# EAGLE design Xmega (EAGLE 6.2)
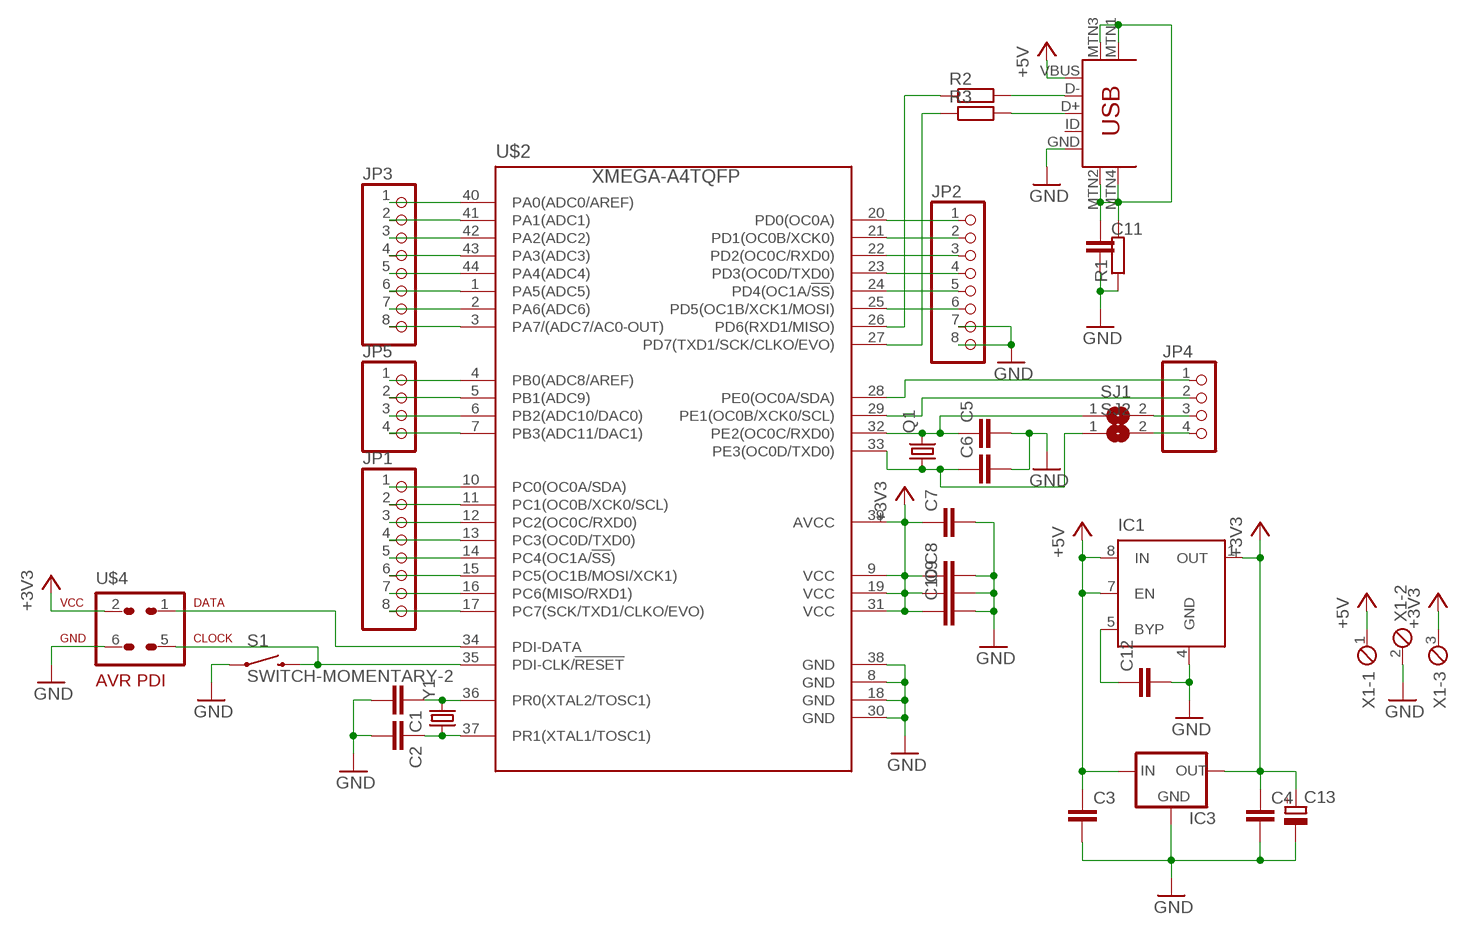
[diagram p0: schematic, sheet 1]

## Parts
C1  C-EUC0603  [C0603]
C2  C-EUC0603  [C0603]
C3  C-EUC0805  [C0805]
C4  C-EUC0805  [C0805]
C5  C-EUC0603  [C0603]
C6  C-EUC0603  [C0603]
C7  C-EUC0603  [C0603]
C8  C-EUC0603  [C0603]
C9  C-EUC0603  [C0603]
C10  C-EUC0603  [C0603]
C11  C-EUC0603  [C0603]
C12  C-EUC0603  [C0603]
C13  CPOL-EUSMCB  [SMC_B]
IC1  TC1269  [MSOP08]
IC3  VREG_3PIN_O-G-ITO92_MID  [TO92_MID]
JP1  PINHD_FIXEDPAD_ROUND-1X8  [1X08_ROUND]
JP2  PINHD_FIXEDPAD_ROUND-1X8  [1X08_ROUND]
JP3  PINHD_FIXEDPAD_ROUND-1X8  [1X08_ROUND]
JP4  PINHD_FIXEDPAD_ROUND-1X4  [1X04_ROUND]
JP5  PINHD_FIXEDPAD_ROUND-1X4  [1X04_ROUND]
Q1  CRYSTALTC26V  [TC26V]
R1  R-EU_R0603  [R0603]
R2  R-EU_R0603  [R0603]
R3  R-EU_R0603  [R0603]
S1  SWITCH-MOMENTARY-2  [TACTILE_SWITCH_TALL]
SJ1  SJ_SMALL  [SJ_2S-NO]
SJ2  SJ_SMALL  [SJ_2S-NO]
U$1  USB-MINIB-5PIN  [USB-MINIB]
U$2  XMEGA-A4TQFP  [TQFP44]
U$4  AVR-PDIVERT  [AVR-ISP-6]
X1  MPT3  [3POL254]
Y1  CRYSTAL5X3  [CRYSTAL-SMD-5X3]

## Nets
+3V3: C4.1 C7.1 C8.1 C9.1 C10.1 C13.+ IC1.1(OUT) IC3.1(OUT) U$2.9(VCC) U$2.19(VCC) U$2.31(VCC) U$2.39(AVCC) U$4.2 X1.3
+5V: C3.1 IC1.7(EN) IC1.8(IN) IC3.3(IN) U$1.VBUS X1.1
GND: C1.2 C2.2 C3.2 C4.2 C5.2 C6.2 C7.2 C8.2 C9.2 C10.2 C11.2 C12.2 C13.- IC1.4(GND) IC3.2(GND) JP2.7 JP2.8 R1.1 S1.A2 U$1.GND U$2.8(GND) U$2.18(GND) U$2.30(GND) U$2.38(GND) U$4.6 X1.2
MTN: C11.1 R1.2 U$1.MTN1(MTN2) U$1.MTN2(MTN3) U$1.MTN3(MTN1) U$1.MTN4
N$1: C1.1 U$2.36(PR0(XTAL2/TOSC1)) Y1.3
N$2: C2.1 U$2.37(PR1(XTAL1/TOSC1)) Y1.1
N$5: JP2.2 U$2.21(PD1(OC0B/XCK0))
N$6: JP2.3 U$2.22(PD2(OC0C/RXD0))
N$7: JP2.4 U$2.23(PD3(OC0D/TXD0))
N$8: JP2.5 U$2.24(PD4(OC1A/!SS!))
N$10: R2.1 U$2.26(PD6(RXD1/MISO))
N$11: R3.1 U$2.27(PD7(TXD1/SCK/CLKO/EVO))
N$17: JP3.2 U$2.41(PA1(ADC1))
N$18: JP3.3 U$2.42(PA2(ADC2))
N$19: JP3.4 U$2.43(PA3(ADC3))
N$20: JP3.5 U$2.44(PA4(ADC4))
N$21: JP3.6 U$2.1(PA5(ADC5))
N$22: JP3.7 U$2.2(PA6(ADC6))
N$25: JP1.2 U$2.11(PC1(OC0B/XCK0/SCL))
N$26: JP1.3 U$2.12(PC2(OC0C/RXD0))
N$27: JP1.4 U$2.13(PC3(OC0D/TXD0))
N$28: JP1.5 U$2.14(PC4(OC1A/!SS!))
N$29: JP1.6 U$2.15(PC5(OC1B/MOSI/XCK1))
N$30: JP1.7 U$2.16(PC6(MISO/RXD1))
N$33: JP5.2 U$2.5(PB1(ADC9))
N$34: JP5.3 U$2.6(PB2(ADC10/DAC0))
N$36: S1.B2 U$2.35(PDI-CLK/!RESET) U$4.5
N$38: R3.2 U$1.D+
N$39: R2.2 U$1.D-
N$40: C12.1 IC1.5(BYP)
N$42: U$2.34(PDI-DATA) U$4.1
XA0: JP3.1 U$2.40(PA0(ADC0/AREF))
XA7: JP3.8 U$2.3(PA7/(ADC7/AC0-OUT))
XB0: JP5.1 U$2.4(PB0(ADC8/AREF))
XB3: JP5.4 U$2.7(PB3(ADC11/DAC1))
XC0: JP1.1 U$2.10(PC0(OC0A/SDA))
XC7: JP1.8 U$2.17(PC7(SCK/TXD1/CLKO/EVO))
XD0: JP2.1 U$2.20(PD0(OC0A))
XD5: JP2.6 U$2.25(PD5(OC1B/XCK1/MOSI))
XE0: JP4.1 U$2.28(PE0(OC0A/SDA))
XE1: JP4.2 U$2.29(PE1(OC0B/XCK0/SCL))
XE2: C5.1 Q1.2 SJ1.1 U$2.32(PE2(OC0C/RXD0))
XE2S: JP4.3 SJ1.2
XE3: C6.1 Q1.1 SJ2.1 U$2.33(PE3(OC0D/TXD0))
XE3S: JP4.4 SJ2.2
Unconnected: U$1.ID

## Library data of the parts
C1-C12 = rcl:C-EU: CAPACITOR, European symbol
C13 = rcl:CPOL-EU: POLARIZED CAPACITOR, European symbol
IC1 = hsa:TC1269: Connecting a 470pF to the BYP input further reduces output noise. The regulator is enabled when a logic high (input voltage x 0.45) is applied to the EN input. Max input voltage 6.0V, max output current 300mA.
IC3 = hsa:VREG_3PIN_O-G-I: Pin order 1:OUT, 2:GND, 3:IN
JP1-JP3 = hsa:PINHD_FIXEDPAD_ROUND-1X8: PIN HEADER
JP4 JP5 = hsa:PINHD_FIXEDPAD_ROUND-1X4: PIN HEADER
Q1 = crystal:CRYSTAL: CRYSTAL; OC_FARNELL: unknown; OC_NEWARK: unknown
R1-R3 = rcl:R-EU_: RESISTOR, European symbol
S1 = SparkFun:SWITCH-MOMENTARY-2
SJ1 SJ2 = hsa:SJ_SMALL: SMD solder JUMPER
U$1 = SparkFun:USB-MINIB: Mini-USB "B" connector with 5th pin broken out. Created new symbol breaking out 5th "ID" pin in mini/micro USB connector spec. See: http://en.wikipedia.org/wiki/Mini_usb#Cables. Uses same footprint as 4-pin symbol. Also added pins to connect to mounting / shield pads if required (probably not generally needed as signals aren't shielded once they leave the connector).
U$2 = avr-7:XMEGA-A4: Atmel XMega A4 series processor
U$4 = avr-7:AVR-PDI: AVR PDI programming interface connector
X1 = con-phoenix-254:MPT3: PHOENIX CONNECTOR; OC_FARNELL: unknown; OC_NEWARK: unknown
Y1 = SparkFun:CRYSTAL: Crystals Various standard crystals. Proven footprints. Spark Fun Electronics SKU : COM-00534

## Board
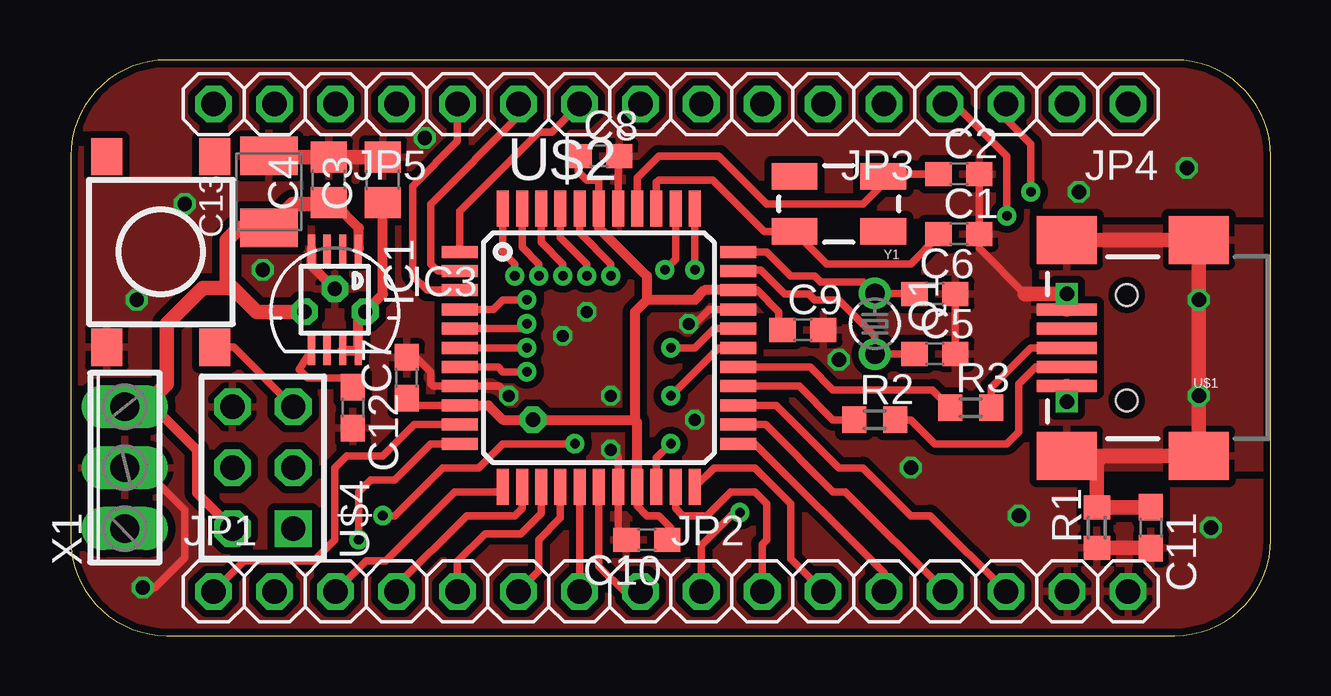
[diagram p1: board, top side]
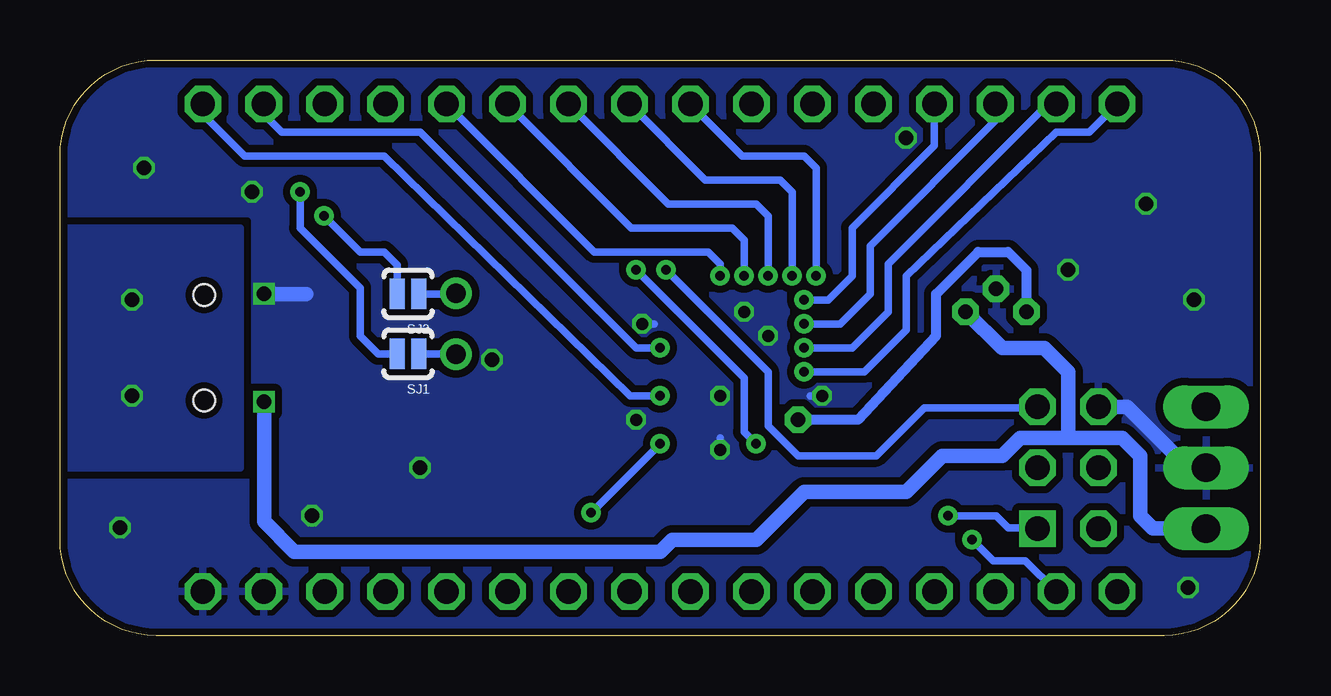
[diagram p2: board, bottom side, seen from below]

Size 50 x 24 mm. Coordinates in mm from the lower left corner, seen from the top.
Outline: 46,0 arc90 50,4 50,20 arc90 46,24 4,24 arc90 0,20 0,4 arc90 4,0 46,0
Copper layers (1*16): Top 0.035mm / dielectric 1.5mm / Bottom 0.035mm
Design rules: minimum track width 6mil, minimum drill 12mil, track to track 6mil, track to pad 6mil, pad to pad 6mil, via to via 6mil, smd to smd 0mil, copper to edge 10mil, drill to drill 10mil, minimum pad ring 10mil, minimum via ring 6mil, stop-mask expansion 2mil, vias tented up to drill 100mil, thermal gap 10mil

### Footprints (pad centres in the part's own frame; a part is rotated, then mirrored left to right if it is on the bottom)
C0603 = smd 1.1 x 1: 1 -0.85,0; 2 0.85,0
C0805 = smd 1.3 x 1.5: 1 -0.95,0; 2 0.95,0
SMC_B = smd 1.6 x 2.4: + -1.5,0; - 1.5,0
MSOP08 = smd 0.3 x 1.2: 1 -0.976,-2.113; 2 -0.326,-2.113; 3 0.324,-2.113; 4 0.974,-2.113; 5 0.974,2.112; 6 0.324,2.112; 7 -0.326,2.112; 8 -0.976,2.112
TO92_MID = drill 0.6 octagon: 1 -1.27,0; 2 0,0.953; 3 1.27,0
1X08_ROUND = drill 1.016 pad 1.524 octagon: 1 -8.89,0; 2 -6.35,0; 3 -3.81,0; 4 -1.27,0; 5 1.27,0; 6 3.81,0; 7 6.35,0; 8 8.89,0
1X04_ROUND = drill 1.016 pad 1.524 octagon: 1 -3.81,0; 2 -1.27,0; 3 1.27,0; 4 3.81,0
TC26V = drill 0.813: 1 -1.27,0; 2 1.27,0
R0603 = smd 1 x 1.1: 1 -0.85,0; 2 0.85,0
TACTILE_SWITCH_TALL = smd 1.55 x 1.3: A1 -3.975,-2.25; A2 3.975,-2.25; B1 -3.975,2.25; B2 3.975,2.25
SJ_2S-NO = smd 0.635 x 1.27: 1 -0.45,0; 2 0.45,0
USB-MINIB = smd 2.5 x 0.5: D+ 2.5,0; D- 2.5,0.8; GND 2.5,-1.6; ID 2.5,-0.8; VBUS 2.5,1.6 | smd 2.5 x 2: MTN1 -3,4.5; MTN2 2.5,4.5; MTN3 -3,-4.5; MTN4 2.5,-4.5 | hole 0.9: 0,2.2; 0,-2.2
TQFP44 = smd 1.5 x 0.5: 1 -5.8,4; 2 -5.8,3.2; 3 -5.8,2.4; 4 -5.8,1.6; 5 -5.8,0.8; 6 -5.8,0; 7 -5.8,-0.8; 8 -5.8,-1.6; 9 -5.8,-2.4; 10 -5.8,-3.2; 11 -5.8,-4; 23 5.8,-4; 24 5.8,-3.2; 25 5.8,-2.4; 26 5.8,-1.6; 27 5.8,-0.8; 28 5.8,0; 29 5.8,0.8; 30 5.8,1.6; 31 5.8,2.4; 32 5.8,3.2; 33 5.8,4 | smd 0.5 x 1.5: 12 -4,-5.8; 13 -3.2,-5.8; 14 -2.4,-5.8; 15 -1.6,-5.8; 16 -0.8,-5.8; 17 0,-5.8; 18 0.8,-5.8; 19 1.6,-5.8; 20 2.4,-5.8; 21 3.2,-5.8; 22 4,-5.8; 34 4,5.8; 35 3.2,5.8; 36 2.4,5.8; 37 1.6,5.8; 38 0.8,5.8; 39 0,5.8; 40 -0.8,5.8; 41 -1.6,5.8; 42 -2.4,5.8; 43 -3.2,5.8; 44 -4,5.8
AVR-ISP-6 = drill 1.016 square: 1 -2.54,-1.27 | drill 1.016 octagon: 2 -2.54,1.27; 3 0,-1.27; 4 0,1.27; 5 2.54,-1.27; 6 2.54,1.27
3POL254 = drill 1.2 long: 1 -2.54,0; 2 0,0; 3 2.54,0
CRYSTAL-SMD-5X3 = smd 1.9 x 1.1: 1 -1.85,-1.15; 2 1.85,-1.15; 3 1.85,1.15; 4 -1.85,1.15

### Placement (x,y rotation side)
C1  37,16.75 0 top
C2  37,19.25 0 top
C3  13,19 90 top
C4  10.75,19 90 top
C5  36,11.75 0 top
C6  36,14.25 0 top
C7  14,10.75 90 top
C8  22,20 0 top
C9  30.5,12.75 0 top
C10  24,4 180 top
C11  45,4.5 270 top
C12  11.75,9.5 270 top
C13  8.25,18.5 90 top
IC1  11,14 180 top
IC3  11,13.5 0 top
JP1  14.84,1.84 0 top
JP2  35.16,1.84 0 top
JP3  25,22.16 180 top
JP4  40.24,22.16 180 top
JP5  9.76,22.16 180 top
Q1  33.5,13 270 top
R1  42.75,4.5 90 top
R2  33.5,9 0 top
R3  37.5,9.5 0 top
S1  3.75,16 270 top
SJ1  35.5,11.75 180 bottom
SJ2  35.5,14.25 180 bottom
U$1  44,12 180 top
U$2  22,12 0 top
U$4  8,7 90 top
X1  2.25,7 90 top
Y1  32,18 180 top

### Tracks (layer width: path | path; a pad name or v marks a point on that pad's centre or on a via)
+3V3  (via drill 0.6 pad 1.1)
  Top 0.305: U$2.19 23.6,5.4 24,5 24.5,5 25,4.5 24.85,4.35 C10.1 | U$2.9 14.3,9.6 C7.1 | U$2.39 22,19 21.5,19 21.15,19.35 C8.1 | U$2.31 28.6,14.4 29.5,13.5 29.5,12.9 C9.1 | 12,16.14 IC1.1
  Top 0.406: 23.5,9 v19.25,9 18,9 17.4,9.6 U$2.9 | U$2.31 26.4,14.4 26,14 24,14 | U$2.19 23.6,8.9 23.5,9 | U$2.39 22,17 24,15 24,14 | 24,14 23.5,13.5 23.5,9 | 9.95,18 C4.1 10.95,18.05 12,17 12,16.14 | X1.3 3.46,9.54 5.25,7.75 5.25,5.94 U$4.2
  Top 0.61: X1.3 3.04,9.54 4,10.5 4,13 5.5,14.5 6.5,14.5 | 6.5,14.5 6.75,14.5 7.75,13.5 IC3.1 | 9.95,18 9.25,18 C13.+ 7,17 6.5,16.5 6.5,14.5
  Bottom 0.406: v19.25,9 16.75,9 13.5,12.5 13.5,14.25 11.75,16 10.5,16 9.73,15.23 IC3.1
+5V  (via drill 0.6)
  Top 0.406: IC1.7 IC1.8 11.98,13.21 IC3.3 13,14.23 C3.1
  Top 0.61: U$1.VBUS v41.5,9.75
  Bottom 0.61: v41.5,9.75 41.5,4.77 40.23,3.5 25,3.5 24.5,4 21,4 19,6 14.75,6 13.25,7.5 10.75,7.5 10,8.25 8,8.25 | 8,8.25 5.75,8.25 5,7.5 5,5 4.46,4.46 X1.1 | 8,8.25 8,11 9,12 10.75,12 IC3.3
GND  (via drill 0.5, 0.6)
  Top 0.305: C10.2 22.8,4.35 U$2.18 22.8,7.45 v22.5,7.75 | C7.2 14.4,11.6 15,11 15,10.5 15.1,10.4 U$2.8 17.85,10.4 v18.25,10 | U$2.38 22.8,19.95 C8.2 | C6.2 C5.2 | C2.2 C1.2 37.85,16.15 39.75,14.25 | U$2.30 26.6,13.6 26,13 v25.75,13 | v3,2 3.5,2 4.75,3.25 4.75,5.25 3,7 X1.2
  Top 0.406: IC1.4 10.03,15.43 IC3.2
  Top 0.61: C3.2 C4.2 8.3,19.95 C13.- | C11.2 R1.1 | U$1.GND v41.5,14.25 39.75,14.25
  Bottom 0.305: v18.25,10 18.75,10 | v22.5,7.75 22.5,8.25 | v25.75,13 25.25,13
  Bottom 0.61: v41.5,14.25 39.75,14.25 | X1.2 3,7 5.54,9.54 U$4.6
  other vias: 32,11.5 22.5,10 20.5,12.5 21.5,13.5 2.75,14 4.75,18 39.5,5 47.5,4.5 42,18.5 8,15.25 26,9 46.5,19.5 35,7 14.75,20.75
  pour Bottom (isolate 0.305, rank 2): -2,26 52,26 52,-2 -2,-2
  pour Top (isolate 0.305, rank 2): -1,25 51,25 51,-1 -1,-1
MTN  (via drill 0.6)
  Top 0.61: 43,7.5 U$1.MTN1 v47,10 U$1.MTN3 U$1.MTN4 | 43,7.5 U$1.MTN2 | C11.1 R1.2 42.75,7.25 43,7.5
  other vias: 47,14
  pour Top (isolate 0.305): 53,17 40.5,17 40.5,7 53,7
  pour Bottom (isolate 0.305): 54,17 42.5,17 42.5,7 54,7
N$1
  Top 0.305: U$2.36 24.4,18.9 24.5,19 26.75,19 28.9,16.85 Y1.3 31.5,15.5 35,15.5 36.15,16.65 C1.1
N$2
  Top 0.305: U$2.37 23.6,19.1 24.5,20 27,20 29,18 33,18 33.85,18.85 Y1.1 33.95,19.25 C2.1
N$5
  Top 0.305: U$2.21 25.2,5.3 25.5,5 26.5,5 27.5,6 28.5,6 29,5.5 29,4 28.81,3.81 JP2.2
N$6
  Top 0.305: U$2.22 26.8,7 28.5,7 30,5.5 30,3.19 JP2.3
N$7
  Top 0.305: 27.8,7.93 U$2.23 28.5,8 33.89,2.61 JP2.4
N$8
  Top 0.305: U$2.24 28.95,8.8 31.75,6 32.27,6 JP2.5
N$10
  Top 0.305: U$2.26 30.35,10.4 31.75,9 R2.1
N$11
  Top 0.305: U$2.27 30.8,11.2 31.75,10.25 35.9,10.25 R3.1
N$17  (via drill 0.4 pad 0.8)
  Top 0.305: U$2.41 20.4,16.6 21.5,15.5 v21.5,15
  Bottom 0.305: v21.5,15 21.5,16.5 22,17 26.19,17 JP3.2
N$18  (via drill 0.4 pad 0.8)
  Top 0.305: U$2.42 19.6,16.4 20.5,15.5 v20.5,15
  Bottom 0.305: v20.5,15 20.5,17.5 21,18 24.65,18 JP3.3
N$19  (via drill 0.4 pad 0.8)
  Top 0.305: U$2.43 18.8,16.2 19.5,15.5 v19.5,15
  Bottom 0.305: v19.5,15 19.5,18.5 20,19 23.11,19 JP3.4
N$20  (via drill 0.4 pad 0.8)
  Top 0.305: U$2.44 18,16 18.5,15.5 v18.5,15
  Bottom 0.305: v18.5,15 18.5,19.5 19,20 21.57,20 JP3.5
N$21
  Top 0.305: U$2.1 16.2,17.7 19.5,21 20.03,21 JP3.6
N$22
  Top 0.305: U$2.2 15.3,15.2 15,15.5 15,18 18.65,21.65 JP3.7
N$25  (via drill 0.4 pad 0.8)
  Top 0.305: v12,4 12,6 12.5,6.5 13.5,6.5 15,8 U$2.11
  Bottom 0.305: JP1.2 9.78,3.12 11.12,3.12 v12,4
N$26
  Top 0.305: U$2.12 17.8,6 16,6 13.12,3.12 12.31,3.12 JP1.3
N$27
  Top 0.305: U$2.13 18.8,5.3 18.5,5 16.5,5 13.57,2.07 JP1.4
N$28
  Top 0.305: U$2.14 19.6,5.1 18.75,4.25 17.27,4.25 16.11,3.09 JP1.5
N$29
  Top 0.305: U$2.15 20.4,4.9 19.5,4 19.5,2.69 JP1.6
N$30
  Top 0.305: U$2.16 JP1.7
N$33  (via drill 0.4 pad 0.8)
  Top 0.305: U$2.5 18.8,12.8 v19,13
  Bottom 0.305: v19,13 17.5,13 16.25,14.25 16.25,16.25 11.03,21.47 JP5.2
N$34  (via drill 0.4 pad 0.8)
  Top 0.305: U$2.6 v19,12
  Bottom 0.305: v19,12 17,12 15.5,13.5 15.5,15.5 8.84,22.16 JP5.3
N$36  (via drill 0.4 pad 0.8)
  Top 0.305: v24.75,15.25 25.2,15.7 U$2.35 | S1.B2 6.79,12.02 U$4.5
  Bottom 0.305: v24.75,15.25 20.5,11 20.5,8.75 19.25,7.5 16,7.5 14,9.5 9.31,9.5 U$4.5
N$38
  Top 0.305: R3.2 38.35,10.35 40,12 U$1.D+
N$39
  Top 0.305: U$1.D- 40.2,11.2 39.5,10.5 39.5,8.5 39,8 36,8 35,9 R2.2
N$40
  Top 0.305: IC1.5 9.53,11.1 9.88,10.75 11.35,10.75 C12.1
N$42  (via drill 0.4 pad 0.8)
  Top 0.305: U$2.34 v26,15.25 | v13,5 13.5,5 13.62,5.12 15.5,7 17,7 18,8 v21,8
  Bottom 0.305: v26,15.25 21.5,10.75 21.5,8.5 v21,8 | v13,5 11,5 10.5,4.5 9.31,4.5 U$4.1
XA0  (via drill 0.4 pad 0.8)
  Top 0.305: U$2.40 21.2,16.8 22.5,15.5 v22.5,15
  Bottom 0.305: v22.5,15 22.5,15.5 23,16 27.73,16 JP3.1
XA7
  Top 0.305: U$2.3 14.85,14.4 14.25,15 14.25,18.75 16.11,20.61 JP3.8
XB0  (via drill 0.4 pad 0.8)
  Top 0.305: U$2.4 17.6,13.6 18,14 v19,14
  Bottom 0.305: v19,14 18,14 17,15 17,17 13.57,20.43 JP5.1
XB3  (via drill 0.4 pad 0.8)
  Top 0.305: U$2.7 17.8,11.2 18,11 v19,11
  Bottom 0.305: v19,11 16.5,11 14.75,12.75 14.75,15 8.5,21 7.11,21 JP5.4
XC0
  Top 0.305: U$2.10 14.3,8.8 13,7.5 11.5,7.5 11,7 11,4 10.12,3.12 7.24,3.12 JP1.1
XC7
  Top 0.305: U$2.17 22,2.89 23.05,1.84 JP1.8
XD0  (via drill 0.4 pad 0.8)
  Top 0.305: v25,8 24.4,7.4 U$2.20 | v27.88,5.12 27.62,5.12 26.27,3.77 JP2.1
  Bottom 0.305: v27.88,5.12 v25,8
XD5
  Top 0.305: U$2.25 29.4,9.6 32,7 33,7 35,5 35.81,5 JP2.6
XE0  (via drill 0.4 pad 0.8)
  Top 0.305: U$2.28 27,12 v25,10
  Bottom 0.305: v25,10 26.25,10 36.5,20 42.31,20 44.05,21.74 JP4.1
XE1  (via drill 0.4 pad 0.8)
  Top 0.305: U$2.29 26.8,12.8 26,12 v25,12
  Bottom 0.305: v25,12 26,12 35,21 40.77,21 41.51,21.74 JP4.2
XE2
  Top 0.305: C5.1 35.13,11.73 Q1.2 33.5,12.5 32,14 31,14 30.75,14.25 29.75,14.25 28.75,15.25 27.85,15.25 U$2.32
  Bottom 0.305: SJ1.1 Q1.2
XE2S  (via drill 0.4 pad 0.8)
  Top 0.305: v40,18.5 40,20.5 38.97,21.53 JP4.3
  Bottom 0.305: v40,18.5 40,17 37.5,14.5 37.5,12.5 36.75,11.75 SJ1.2
XE3
  Top 0.305: C6.1 35.13,14.27 Q1.1 33.02,14.75 31.25,14.75 31,15 30,15 29,16 U$2.33
  Bottom 0.305: SJ2.1 33.52,14.25 Q1.1
XE3S  (via drill 0.4 pad 0.8)
  Top 0.305: v39,17.5 39,20 36.84,22.16 JP4.4
  Bottom 0.305: v39,17.5 37.5,16 36.5,16 35.95,15.45 SJ2.2

### Text on the board
tTest: A | E | B | #59319 | C | D | USB
bTest: B3 | B2 | B1 | B0 | A7 | A6 | A5 | A4 | A3 | A2 | A1 | A0 | E3 | E2 | E1 | E0 | #59319 | VCC | GND | GND | C2 | C3 | C4 | C5 | C6 | C7 | D0 | D1 | D2 | D3 | D4 | D5 | USB